# EAGLE design motor control (EAGLE 6.0)
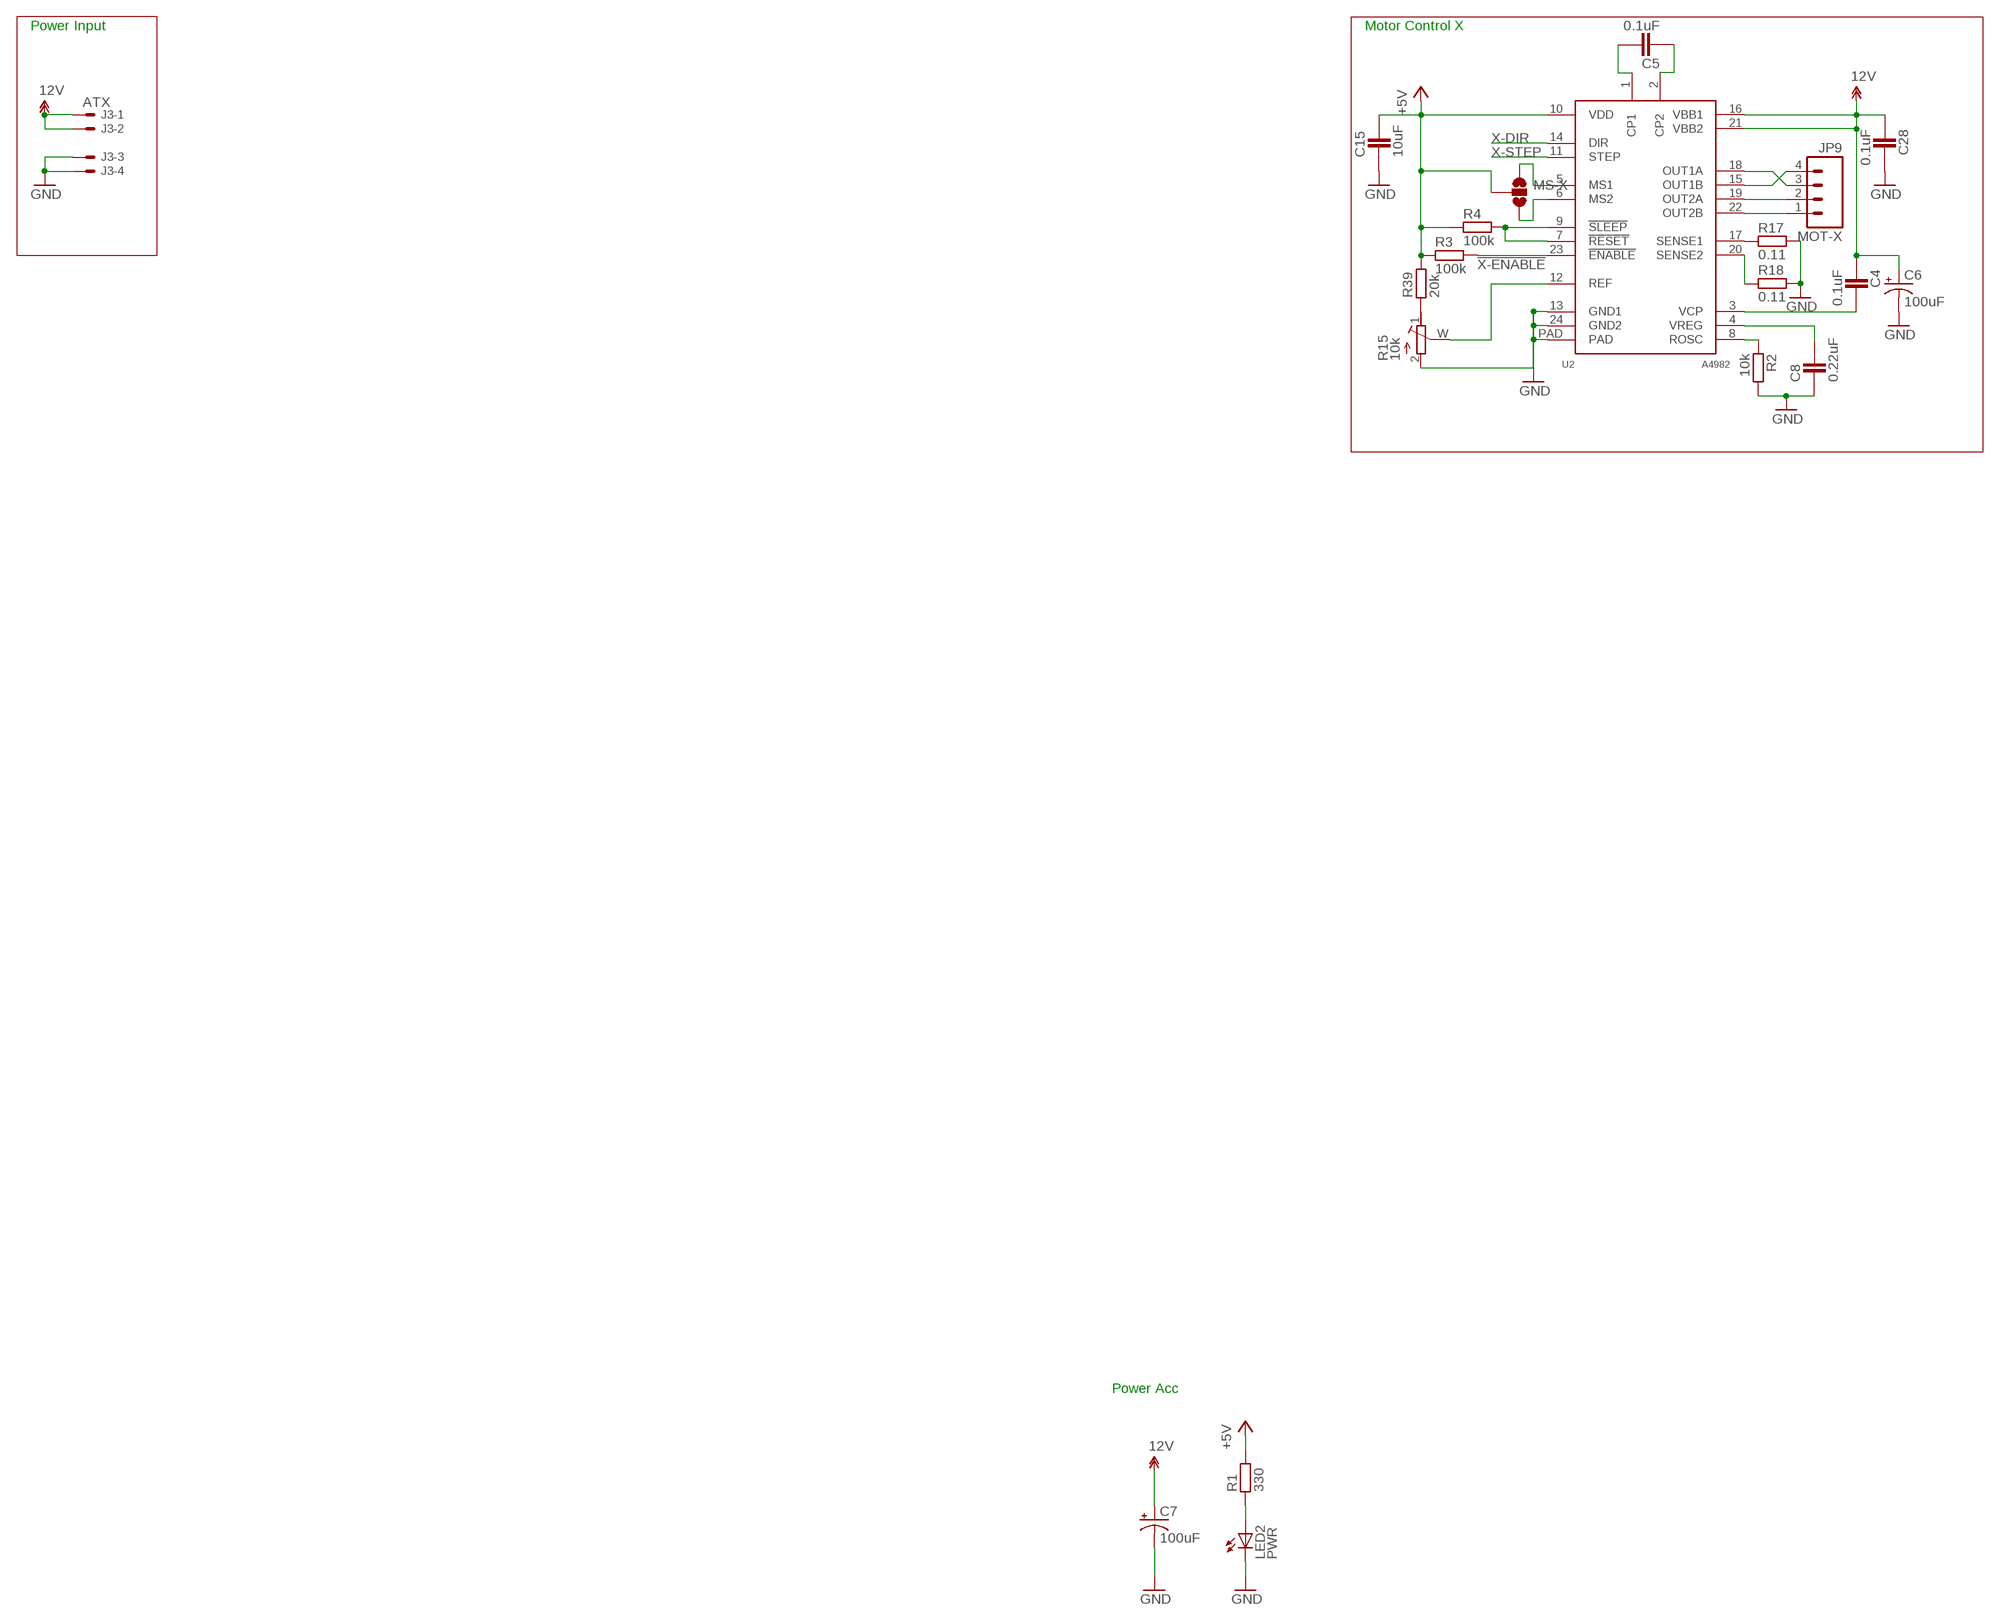
[diagram p0: schematic, sheet 1]

## Parts
C4  0.1uF  CAPACITOR_0805  [CAPC2012X145AN]
C5  0.1uF  CAPACITOR_0805  [CAPC2012X145AN]
C6  100uF  CPOL-USD  [PANASONIC_D]
C7  100uF  CPOL-USD  [PANASONIC_D]
C8  0.22uF  CAPACITOR_0805  [CAPC2012X145AN]
C15  10uF  CAPACITOR_0805  [CAPC2012X145AN]
C28  0.1uF  CAPACITOR_0805  [CAPC2012X145AN]
J3  ATX  5566-4  [5566-4]
JP9  MOT-X  M04POLAR  [MOLEX-1X4]
LED2  PWR  LEDCHIP-LED0805  [CHIP-LED0805]
MS-X  SOLDERJUMPER_2WAYCONNECTED  [SJ_3_CONNECTED]
R1  330  RESISTOR_0805  [RESC2012X70N]
R2  10k  RESISTOR_0805  [RESC2012X70N]
R3  100k  RESISTOR_0805  [RESC2012X70N]
R4  100k  RESISTOR_0805  [RESC2012X70N]
R15  10k  RTRIM-ST-4EA  [RTRIM-ST4ETB]
R17  0.11  RESISTOR_0805  [RESC2012X70N]
R18  0.11  RESISTOR_0805  [RESC2012X70N]
R39  20k  RESISTOR_0805  [RESC2012X70N]
U2  A4982  [TSSOP-24]

## Nets
12V: C4.1 C6.+ C7.+ C28.1 J3.1 J3.2 U2.16(VBB1) U2.21(VBB2)
!X-ENABLE: R3.2 U2.23(!ENABLE)
+5V [power]: C15.2 MS-X.2 R1.2 R3.1 R4.1 R39.2 U2.10(VDD)
GND [power]: C6.- C7.- C8.1 C15.1 C28.2 J3.3 J3.4 LED2.C R2.2 R15.2(E) R17.2 R18.2 U2.13(GND1) U2.24(GND2) U2.PAD
N$1: LED2.A R1.1
N$10: JP9.3 U2.18(OUT1A)
N$11: C5.2 U2.1(CP1)
N$12: C5.1 U2.2(CP2)
N$13: R2.1 U2.8(ROSC)
N$14: R17.1 U2.17(SENSE1)
N$15: R18.1 U2.20(SENSE2)
N$16: C4.2 U2.3(VCP)
N$17: JP9.4 U2.15(OUT1B)
N$18: R15.W(S) U2.12(REF)
N$19: C8.2 U2.4(VREG)
N$20: JP9.2 U2.19(OUT2A)
N$21: R4.2 U2.7(!RESET) U2.9(!SLEEP)
N$23: JP9.1 U2.22(OUT2B)
N$27: MS-X.1 U2.5(MS1)
N$28: MS-X.3 U2.6(MS2)
N$69: R15.1(A) R39.1
X-DIR: U2.14(DIR)
X-STEP: U2.11(STEP)

## Notes on the sheet
- Power Input | Motor Control X
- Power Acc

## Library data of the parts
C4 C5 C8 C15 C28 = ipc-7351-capacitor:CAPACITOR_
C6 C7 = rcl:CPOL-US: POLARIZED CAPACITOR, American symbol
J3 = printrbot:5566-4: Mini FIT connector 4 pol Source: http://www.molex.com; OC_FARNELL: unknown; OC_NEWARK: unknown
JP9 = SparkFun:M04: Header 4 Standard 4-pin 0.1" header. Use with straight break away headers (SKU : PRT-00116), right angle break away headers (PRT-00553), swiss pins (PRT-00743), machine pins (PRT-00117), and female headers (PRT-00115). Molex polarized connector foot print use with SKU : PRT-08231 with associated crimp pins and housings. 1MM SMD Version SKU: PRT-10208
LED2 = led:LED: LED OSRAM: - CHIPLED LG R971, LG N971, LY N971, LG Q971, LY Q971, LO R971, LY R971 LH N974, LH R974 LS Q976, LO Q976, LY Q976 LO Q996 - Hyper CHIPLED LW Q18S LB Q993, LB Q99A, LB R99A - SideLED LS A670, LO A670, LY A670, LG A670, LP A670 LB A673, LV A673, LT A673, LW A673 LH A674 LY A675 LS A676, LA A676, LO A676, LY A676, LW A676 LS A679, LY A679, LG A679 - Hyper Micro SIDELED® LS Y876, LA Y876, LO Y876, LY Y876 LT Y87S - SmartLED LW L88C, LW L88S LB L89C, LB L89S, LG L890 LS L89K, LO L89K, LY L89K LS L896, LA L896, LO L896, LY L896 - TOPLED LS T670, LO T670, LY T670, LG T670, LP T670 LSG T670, LSP T670, LSY T670, LOP T670, LYG T670 LG T671, LOG T671, LSG T671 LB T673, LV T673, LT T673, LW T673 LH T674 LS T676, LA T676, LO T676, LY T676, LB T676, LH T676, LSB T676, LW T676 LB T67C, LV T67C, LT T67C, LS T67K, LO T67K, LY T67K, LW E67C LS E67B, LA E67B, LO E67B, LY E67B, LB E67C, LV E67C, LT E67C LW T67C LS T679, LY T679, LG T679 LS T770, LO T770, LY T770, LG T770, LP T770 LB T773, LV T773, LT T773, LW T773 LH T774 LS E675, LA E675, LY E675, LS T675 LS T776, LA T776, LO T776, LY T776, LB T776 LHGB T686 LT T68C, LB T68C - Hyper Mini TOPLED® LB M676 - Mini TOPLED Santana® LG M470 LS M47K, LO M47K, LY M47K Source: http://www.osram.convergy.de LUXEON: - LUMILED® LXK2-PW12-R00, LXK2-PW12-S00, LXK2-PW14-U00, LXK2-PW14-V00 LXK2-PM12-R00, LXK2-PM12-S00, LXK2-PM14-U00 LXK2-PE12-Q00, LXK2-PE12-R00, LXK2-PE12-S00, LXK2-PE14-T00, LXK2-PE14-U00 LXK2-PB12-K00, LXK2-PB12-L00, LXK2-PB12-M00, LXK2-PB14-N00, LXK2-PB14-P00, LXK2-PB14-Q00 LXK2-PR12-L00, LXK2-PR12-M00, LXK2-PR14-Q00, LXK2-PR14-R00 LXK2-PD12-Q00, LXK2-PD12-R00, LXK2-PD12-S00 LXK2-PH12-R00, LXK2-PH12-S00 LXK2-PL12-P00, LXK2-PL12-Q00, LXK2-PL12-R00 Source: www.luxeon.com KINGBRIGHT: KA-3528ASYC Source: www.kingbright.com
MS-X = printrbot:SOLDERJUMPER_2WAY: Solder Jumper 2 way solder jumper
R1-R4 R17 R18 R39 = ipc-7351-resistor:RESISTOR_
R15 = printrbot:RTRIM-ST-4EA
U2 = printrbot:A4982

## Board
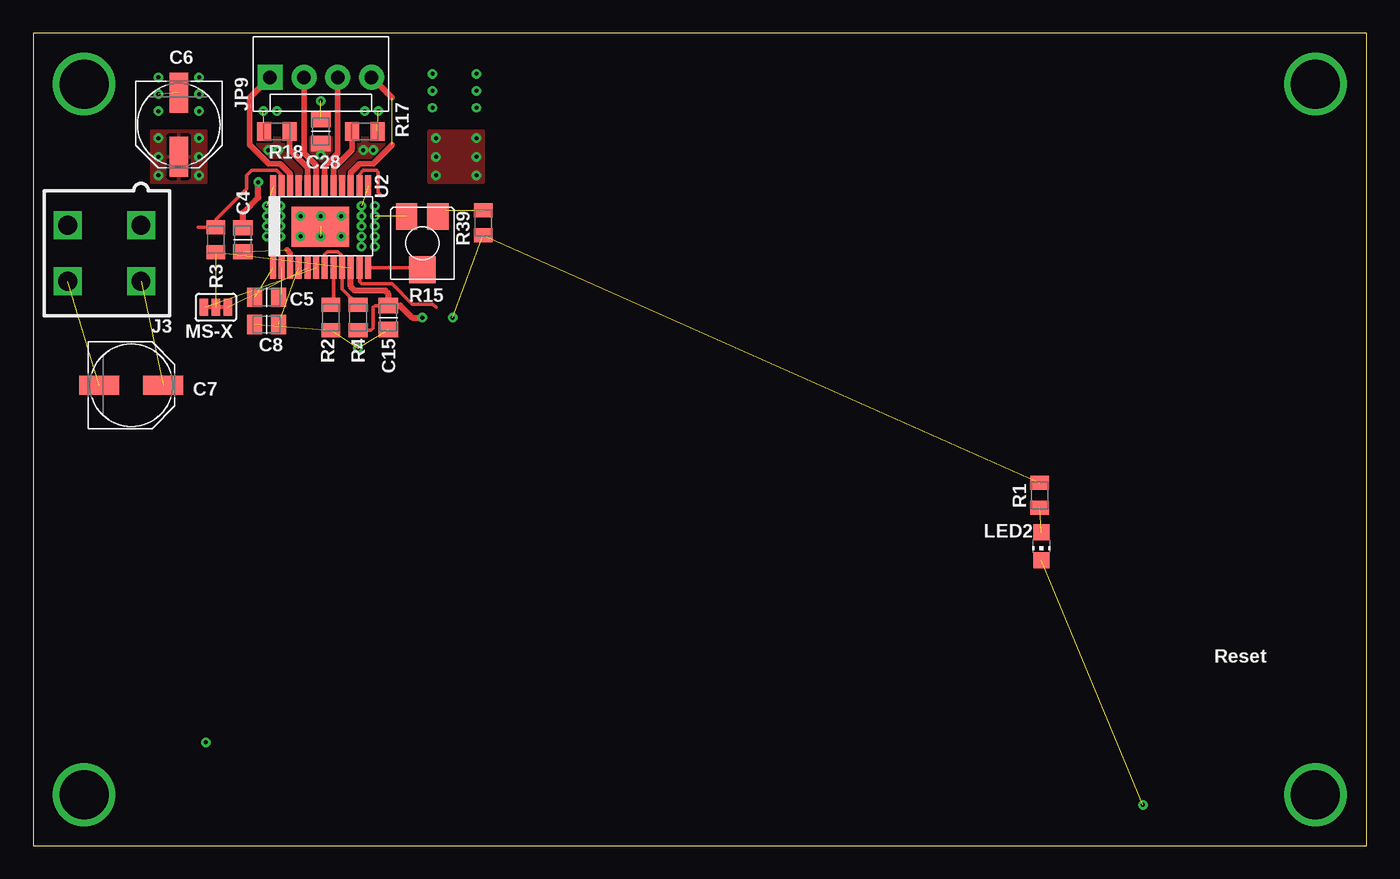
[diagram p1: board, top side]
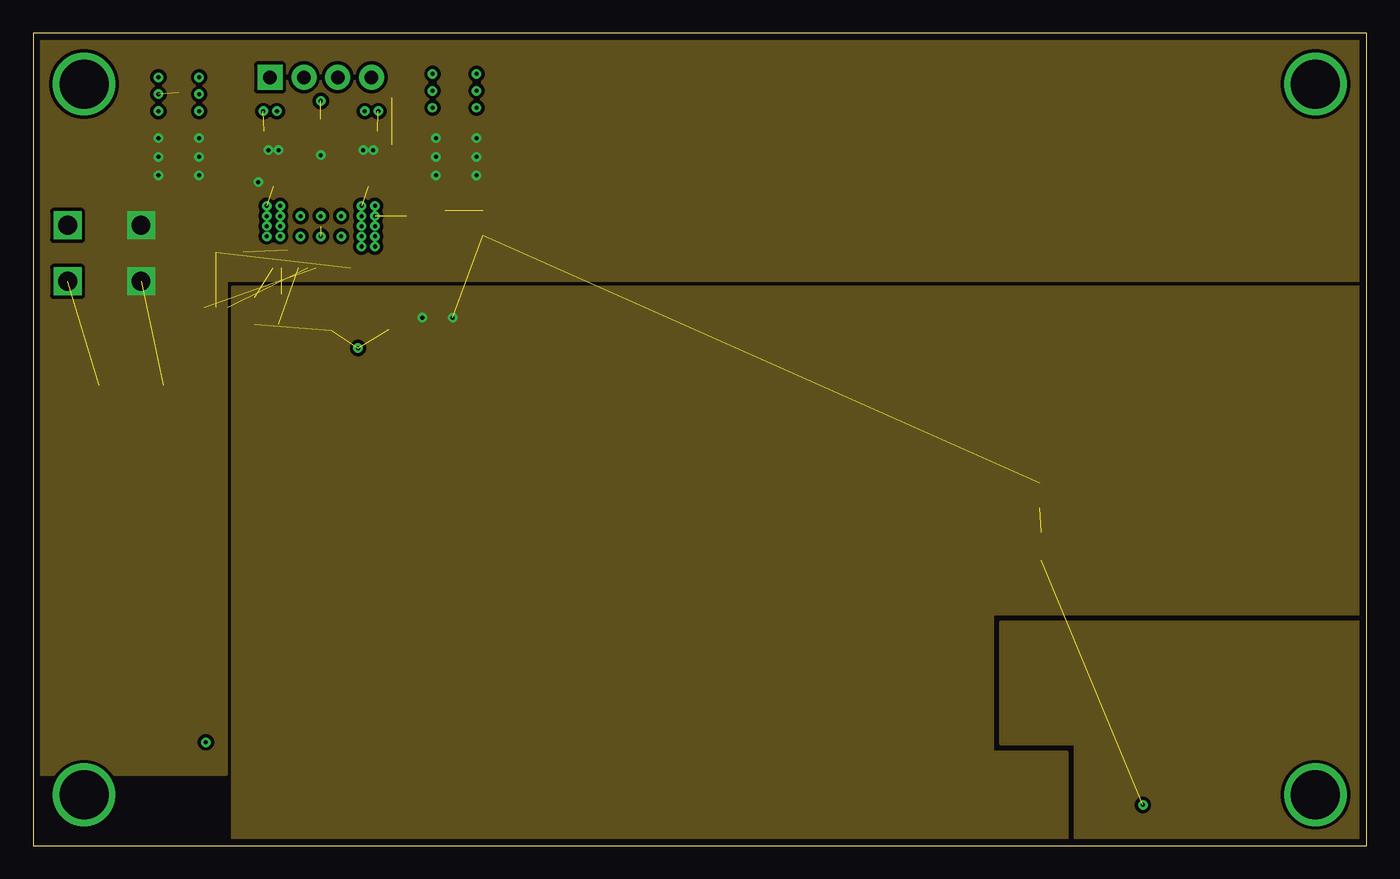
[diagram p2: board, inner layer PWR]
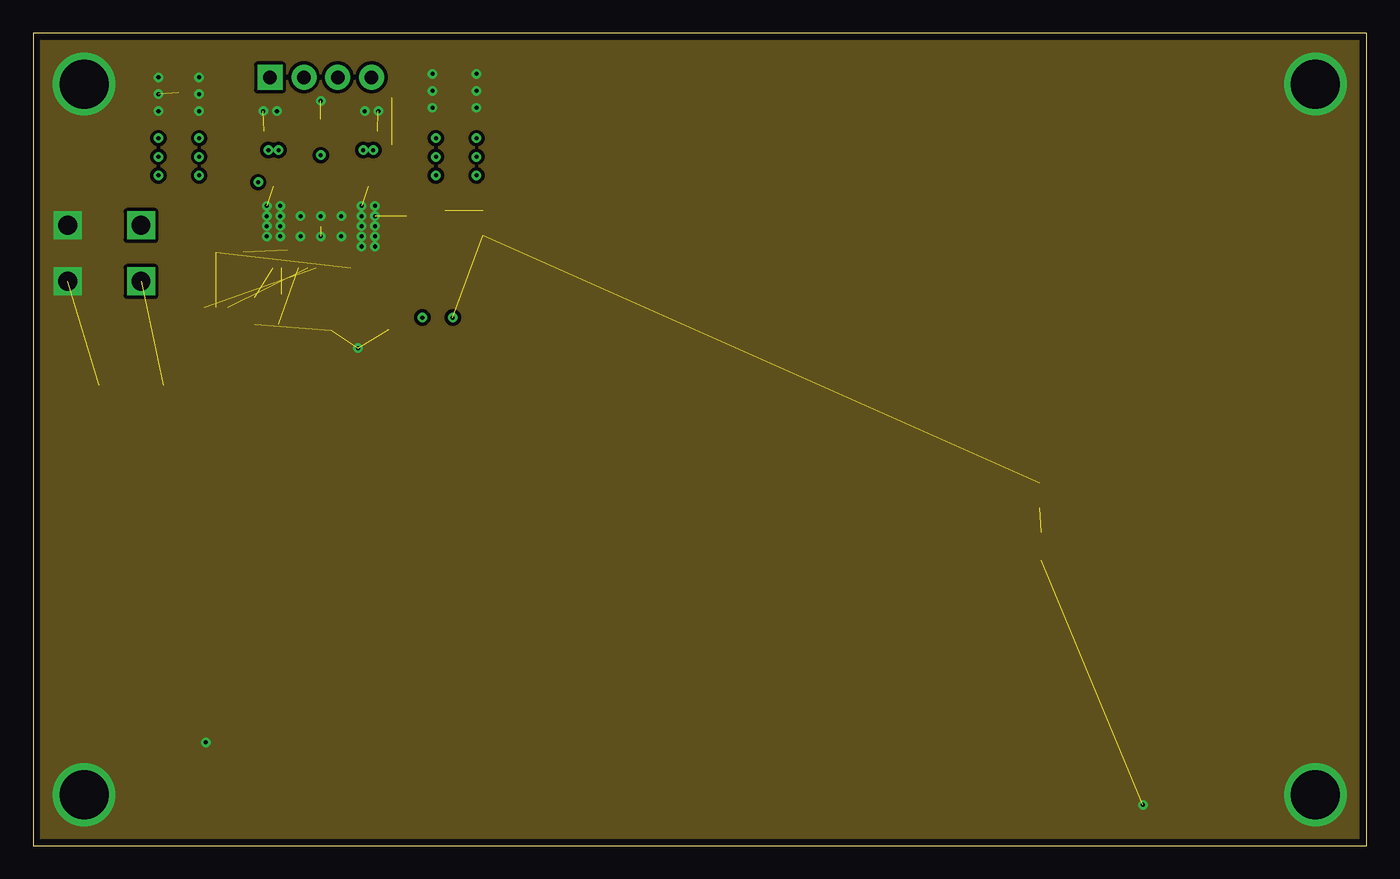
[diagram p3: board, inner layer GND]

Size 100.08 x 60.96 mm. Coordinates in mm from the lower left corner, seen from the top.
Outline: 0,60.96 0,0 100.08,0 100.08,60.96 0,60.96
Copper layers (1*2+3*16): Top 0.035mm / dielectric 0.6mm / PWR 0.035mm / dielectric 0.2mm / GND 0.035mm / dielectric 0.6mm / Bottom 0.035mm
Design rules: minimum track width 6mil, minimum drill 12mil, track to track 6mil, track to pad 7mil, pad to pad 6mil, via to via 6mil, smd to smd 0mil, copper to edge 20mil, drill to drill 10mil, minimum pad ring 10mil, minimum via ring 8mil, stop-mask expansion 6mil, vias tented up to drill 100mil, thermal gap 10mil

### Footprints (pad centres in the part's own frame; a part is rotated, then mirrored left to right if it is on the bottom)
CAPC2012X145AN = smd 1.15 x 1.45: 1 -0.9,0; 2 0.9,0
PANASONIC_D = smd 3 x 1.4: + 2.4,0; - -2.4,0
5566-4 = drill 1.4 square: 1 2.1,-2.75; 2 -2.1,-2.75; 3 2.1,2.75; 4 -2.1,2.75
MOLEX-1X4 = drill 1.016 pad 1.88 square: 1 0,0 | drill 1.016 pad 1.88: 2 2.54,0; 3 5.08,0; 4 7.62,0
CHIP-LED0805 = smd 1.2 x 1.2: A 0,-1.05; C 0,1.05
SJ_3_CONNECTED = smd 0.635 x 1.27: 1 -0.889,0; 2 0,0; 3 0.889,0
RESC2012X70N = smd 1.05 x 1.4: 1 -0.95,0; 2 0.95,0
RTRIM-ST4ETB = smd 1.6 x 2: 1 -1.175,-2; 2 1.175,-2 | smd 2 x 2: W 0,2
TSSOP-24 = smd 0.45 x 1.65: 1 -3.6,-3.1; 2 -2.95,-3.1; 3 -2.3,-3.1; 4 -1.65,-3.1; 5 -1,-3.1; 6 -0.35,-3.1; 7 0.3,-3.1; 8 0.95,-3.1; 9 1.6,-3.1; 10 2.25,-3.1; 11 2.9,-3.1; 12 3.55,-3.1; 13 3.55,3; 14 2.9,3; 15 2.25,3; 16 1.6,3; 17 0.95,3; 18 0.3,3; 19 -0.35,3; 20 -1,3; 21 -1.65,3; 22 -2.3,3; 23 -2.95,3; 24 -3.6,3 | smd 4.32 x 3: PAD -0.025,-0.05

### Placement (x,y rotation side)
C4  15.75,45.47 270 top
C5  17.53,41.15 180 top
C6  10.92,54.1 270 top
C7  7.37,34.54 0 top
C8  17.53,39.12 0 top
C15  26.67,39.62 90 top
C28  21.59,53.59 90 top
J3  5.33,44.45 90 top
JP9  17.78,57.66 0 top
LED2  75.69,22.48 180 top
MS-X  13.72,40.39 180 top
R1  75.56,26.29 90 top
R2  22.35,39.62 270 top
R3  13.72,45.47 90 top
R4  24.38,39.62 90 top
R15  29.21,45.21 180 top
R17  24.89,53.59 0 top
R18  18.29,53.59 180 top
R39  33.78,46.74 270 top
U2  21.59,46.48 0 top

### Tracks (layer width: path | path; a pad name or v marks a point on that pad's centre or on a via)
12V  (via drill 0.3)  (1 unrouted)
  Top 0.457: C4.1 15.75,47.5 16.89,48.64 v16.89,49.78
  other vias: 17.65,52.2 25.53,52.2 21.59,51.82 12.45,53.09 12.45,51.69 12.45,50.29 9.4,53.09 9.4,51.69 9.4,50.29 33.27,53.09 33.27,51.69 33.27,50.29 30.23,53.09 30.23,51.69 30.23,50.29 18.41,52.2 24.77,52.2
  pour PWR (isolate 0.254, rank 6): 100.08,42.42 14.48,42.42 14.48,5.33 0,5.33 0,60.96 100.08,60.96
  pour Top (no thermals): 17.65,50.04 25.53,50.04 25.53,51.31 26.8,52.58 26.8,53.09 16.38,53.09 16.38,52.32 17.65,51.05
  pour Top: 9.14,53.59 12.95,53.59 12.95,49.78 8.89,49.78 8.89,53.59
  pour Top (isolate 0.254): 29.97,53.59 33.78,53.59 33.78,49.78 29.72,49.78 29.72,53.59
  pour PWR (isolate 0.254, no thermals): 9.65,48.01 6.6,48.01 6.6,40.89 9.65,40.89
!X-ENABLE
  Top 0.254: U2.23 18.64,50.32 18.29,50.67 16.38,50.67 16,50.29 16,49.28 13.72,46.99 R3.2 12.38,46.42
+3V3
  pour PWR (isolate 0.254): 100.08,16.76 72.64,16.76 72.64,7.62 78.23,7.62 78.23,0 100.08,0
+5V  (via drill 0.3)  (4 unrouted)
  Top 0.254: R4.1 25.34,38.67 25.53,38.86 25.53,40.39 25.65,40.51 26.66,40.51 C15.2
  Top 0.457: U2.10 23.84,41.95 24.13,41.66 26.42,41.66 26.67,41.4 C15.2 27.55,40.52 28.45,39.62 v29.21,39.62 29.09,39.62
  other vias: 31.5,39.62
  pour PWR (isolate 0.254): 100.08,41.91 14.99,41.91 14.99,0 77.6,0 77.6,6.99 72.01,6.99 72.01,17.4 100.08,17.4
GND  (via drill 0.3, 3.68)  (13 unrouted)
  other vias: 96.27,3.81 3.81,3.81 3.81,57.15 96.27,57.15 17.27,55.12 25.91,55.12 20.07,47.24 21.59,47.24 23.11,47.24 20.07,45.72 21.59,45.72 23.11,45.72 18.29,55.12 24.89,55.12 9.4,56.39 9.4,57.66 12.45,56.39 29.97,55.37 29.97,57.91 29.97,56.64 24.38,37.34 12.45,57.66 33.27,57.91 33.27,56.64 33.27,55.37 9.4,55.12 12.45,55.12 21.59,55.88 18.54,48.01 17.53,48.01 17.53,47.24 17.53,46.48 17.53,45.72 18.54,45.72 18.54,46.48 18.54,47.24 24.64,48.01 25.65,48.01 25.65,47.24 25.65,46.48 25.65,45.72 25.65,44.96 24.64,44.96 24.64,45.72 24.64,46.48 24.64,47.24 12.95,7.75 83.31,3.05
  pour GND (isolate 0.254): 0,60.96 100.08,60.96 100.08,0 0,0
  pour GND (isolate 0.254, no thermals): 4.32,48.26 1.02,48.26 1.02,40.64 4.32,40.64
N$1  (1 unrouted)
N$10
  Top 0.406: JP9.3 22.86,51.97 21.89,51 U2.18
N$11  (1 unrouted)
N$12  (1 unrouted)
  Top 0.254: C5.1 18.64,41.36
N$13
  Top 0.254: U2.8 22.54,40.76 R2.1
N$14
  Top 0.406: U2.17 22.54,50.84 23.94,52.24 R17.1
N$15
  Top 0.406: R18.1 19.24,52.24 20.59,50.89 U2.20
N$16  (1 unrouted)
  Top 0.406: U2.3 19.29,44.46 19.05,44.7
N$17  (1 unrouted)
  Top 0.406: U2.15 23.84,50.51 24.51,51.18 25.53,51.18 26.92,52.58 | 26.92,56.13 JP9.4
N$18
  Top 0.254: U2.12 29.04,43.38 R15.W
N$19  (1 unrouted)
N$20
  Top 0.406: JP9.2 20.32,51.97 21.24,51.05 U2.19
N$21
  Top 0.254: U2.7 21.89,44.37 22.1,44.58 22.86,44.58 23.11,44.32 23.11,43.46 U2.9 23.19,41.77 R4.2
N$23
  Top 0.406: U2.22 19.29,50.43 18.54,51.18 17.65,51.18 16.26,52.58 16.26,56.13 JP9.1
N$27  (1 unrouted)
N$28  (1 unrouted)
N$69  (1 unrouted)
  Top 0.254: 30.92,47.69 30.48,47.24 30.42,47.24 R15.1
X-DIR
  Top 0.254: U2.14 24.49,50.4 24.77,50.67 25.78,50.67 25.91,50.55 25.91,49.02 26.16,48.77
X-STEP
  Top 0.254: 30.23,40.39 29.97,40.64 28.45,40.64 26.92,42.16 24.64,42.16 24.49,42.31 U2.11

### Text on the board
tNames: Reset